# Altium schematic sheet Voeding.SchDoc
size A4; SheetNumber: 2; SheetTotal: 4
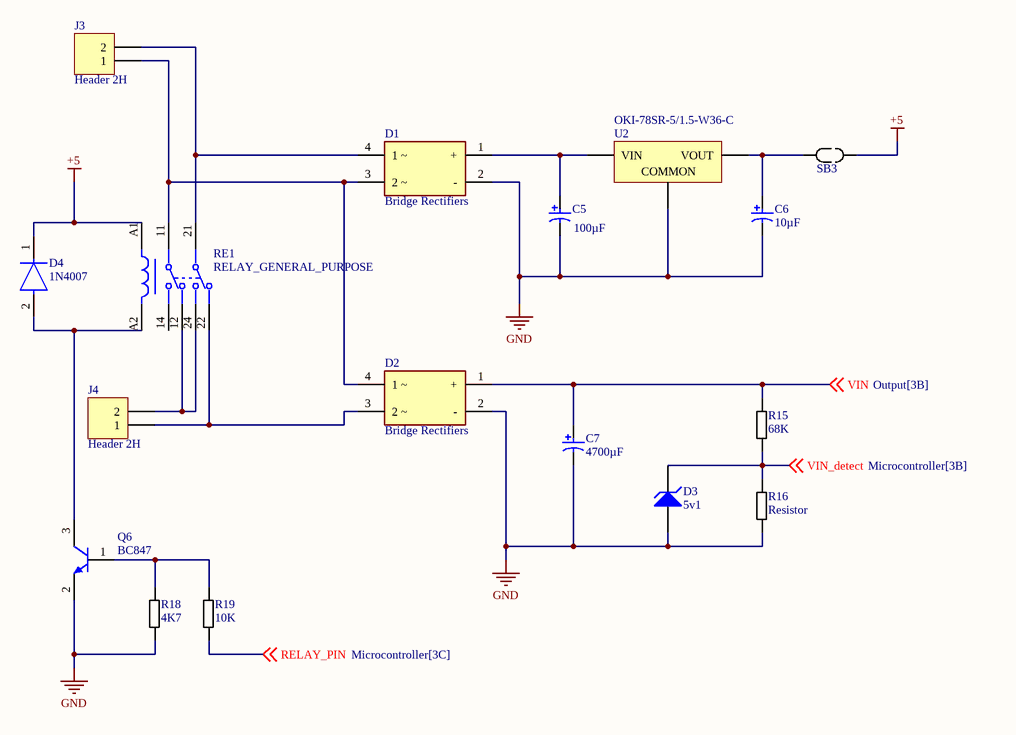
[diagram p0: Voeding.SchDoc]

## Parts
C5  100µF  [CAP-SMD_BD8.0-L8.3-W8.3-FD]
C6  10µF  [CAP-SMD_BD4.0-L4.3-W4.3-FD-LS5.3]
C7  4700µF  [CAP-TH_BD25.0-P10.00-D1.4-FD]
D1  Bridge Rectifiers  [TTF]
D2  Bridge Rectifiers  [TTF]
D3  5v1  [FP-SOD123-IPC_C]
D4  1N4007  [SOD-123FL]
J3  Header 2H  [Connector_2x1_p_5mm]
J4  Header 2H  [Connector_2x1_p_5mm]
Q6  BC847  [FAIR-SOT23-3_V]
R15  68K  [RESC2013X50X30ML20T20]
R16  Resistor  [RESC2013X50X30ML20T20]
R18  4K7  [RESC2013X50X30ML20T20]
R19  10K  [RESC2013X50X30ML20T20]
RE1  RELAY_GENERAL_PURPOSE  [RT42]
SB3  SolderBridge  [SolderBridge_BIG]  (value not drawn)
U2  OKI-78SR-5/1.5-W36-C  [OKI78SR515W36C]

## Nets
+5: D4.1(C) RE1.A1 SB3.2
GND: C5.2(-) C6.2(-) C7.2(-) D1.2(-) D2.2(-) D3.2(A) Q6.2(E) R16.1 R18.1 U2.2(COMMON)
RELAY_PIN: R19.1 ; off-sheet RELAY_PIN
VIN: C7.1(+) D2.1(+) R15.2 ; off-sheet VIN
VIN_detect: D3.1(K) R15.1 R16.2 ; off-sheet VIN_detect
NetC5_1: C5.1(+) D1.1(+) U2.1(VIN)
NetC6_1: C6.1(+) SB3.1 U2.3(VOUT)
NetD1_3: D1.3(2_~) D2.4(1_~) J3.1 RE1.11
NetD1_4: D1.4(1_~) J3.2 RE1.21
NetD2_3: D2.3(2_~) J4.1 RE1.22
NetD4_2: D4.2(A) Q6.3(C) RE1.A2
NetJ4_2: J4.2 RE1.12 RE1.24
NetQ6_1: Q6.1(B) R18.2 R19.2

Not connected (* = marked no-connect by the designer): RE1 14

## Library data of the parts
C5-C7 = Electrolytic capacitor: Manufacturer: Panasonic; Voltage Rating: 25 V; ComponentLink2URL: http://industrial.panasonic.com/cdbs/www-data/pdf/RDE0000/ABA0000C1181.pdf; Height: 10.2 mm; Max Operating Temperature: 105 degC; PackageReference: EEE-FK1E221P; ComponentLink1Description: Manufacturer URL; ComponentLink1URL: http://www.panasonic.com/; Mount: Surface Mount; REACH SVHC: No SVHC; Min Operating Temperature: -55 degC; ComponentLink2Description: Datasheet; DatasheetVersion: 03/2016; Length: 10.2 mm; RoHSCompliant: true; Packaging: Tape and Reel; Package Quantity: 500; Lead Pitch: 3.1 mm; Pins: 2; PackageDescription: 2-Pin Electrolytic Aluminum Capacitor, Body 8.3 x 8.3 mm; Mounting Technology: Surface Mount
D1 D2 = Bridge Rectifiers: Manufacturer Part Number: GBPC3510W T0; Manufacturer: Taiwan Semiconductor; Max Repetitive Reverse Voltage: 1000V; Peak Reverse Current: 5uA; Max Surge Forward Current: 400A; Forward Current: 35A; Max Junction Temp: +150°C; RoHS: TRUE; Package: GBPC-W; Reverse Voltage: 1000V; Temperature Range High: +150°C; Lead Free: Yes; ComponentLink2Description: Datasheet; Temperature Range Low: -55°C; Device Class L3: Rectifier Diodes; Temperature: -55°C to +150°C; Category: Diode; Octopart: https://octopart.com/gbpc3510w+t0-taiwan+semiconductor-12450781; Height: 11.23mm; ComponentLink2URL: https://www.taiwansemi.com/products/datasheet/GBPC%2015005%20SERIES_K14.pdf; Automotive: No; Device Class L2: Diodes; Device Class L1: Discrete Semiconductors
D3 = Zener: Manufacturer: On Semiconductor; PartNumber: 1SMB5928BT3G; VZ Typ (V): 13; Packing: Tape and Reel; PackageDescription: 2-Pin Small Molded Package, J-Bend Lead, Body 4.33 x 3.625 mm; PackageVersion: Rev. H, 05/2011; ComponentLink1Description: Manufacturer URL; Mounting Technology: Surface Mount; ComponentLink1URL: http://www.onsemi.com/; ComponentLink2Description: Datasheet; ComponentLink3URL: http://www.onsemi.com/pub_link/Collateral/1SMB5913BT3-D.PDF; PackageReference: SMB-2-403A-03_H; ComponentLink2URL: http://www.onsemi.com/pub_link/Collateral/1SMB5913BT3-D.PDF; DatasheetVersion: Rev. 8; RoHS: Pb-Free; ComponentLink3Description: Package Specification
D4 = Diode: Manufacturer: Vishay; Manufacturer Part Number: 1N4007-E3/54; Value: 15pF; Max Junction Temp: +150°C; Max Surge Forward Current: 30A; Forward Current: 1A; Max Repetitive Reverse Voltage: 1000V; Peak Reverse Current: 30uA; Octopart: https://octopart.com/1n4007-e3%2F54-vishay-39548207; Digikey Description: DIODE GEN PURP 1KV 1A DO204AL; Category: Diode; Mouser Description: Rectifiers Vr/1000V Io/1A; Automotive: No; Package: 1N4007; Device Class L3: Rectifier Diodes; Temperature Range High: +150°C; Capacitance: 15pF; Ipc Land Pattern Name: DIOPA1088W105L520D270; Lead Free: Yes; ComponentLink2Description: Datasheet; Device Class L1: Discrete Semiconductors; ComponentLink2URL: http://www.vishay.com/docs/88503/1n4001.pdf; Temperature Range Low: -50°C; Height: 2.7mm; RoHS: TRUE; Temperature: -50°C to +150°C; Device Class L2: Diodes
J3 J4 = Header 2H: Header, 2-Pin, Right Angle; LatestRevisionDate: 17-Jul-2002; LatestRevisionNote: Re-released for DXP Platform.; Publisher: Altium Limited
Q6 = NPN Transistor: Manufacturer: On Semiconductor; PartNumber: BC547BRL1G; IC Continuous (A): 0.1; fT Min (MHz): 150; Packing: Tape and Reel; Polarity: NPN; ComponentLink2URL: http://www.onsemi.com/pub_link/Collateral/BC546-D.PDF; ComponentLink1URL: http://www.onsemi.com/; ComponentLink2Description: Datasheet; RoHS: TRUE; ComponentLink3Description: Package Specification; ComponentLink1Description: Manufacturer URL; ComponentLink3URL: http://www.onsemi.com/pub_link/Collateral/MAC97-D.PDF; PackageDescription: 3-Pin Transistor Outline, Body 4.825 x 3.685 mm, Pitch 1.27 mm; PackageVersion: Rev. AM; DatasheetVersion: Rev. 7; Mounting Technology: Through Hole; PackageReference: TO-92-3-29-11_AM_BL
R15 R16 R18 R19 = Resistor: Manufacturer: Vishay Dale; Part Number: CRCW08050000Z0EA
RE1 = RELAY_GENERAL_PURPOSE: Manufacturer Part Number: RT424005; Manufacturer: TE Connectivity; Coil Power: 403mW; Throw Configuration: DPDT; Coil Voltage: 5V; Number Of Contacts: 2; Coil Resistance: 62Ω; Current Rating: 8A; Coil Type: Non-Latching; Category: Relay; Octopart: https://octopart.com/5-1393243-9-te+connectivity-41835766; Device Class L3: Power Relays; ComponentLink2URL: https://www.te.com/commerce/DocumentDelivery/DDEController?Action=showdoc&DocId=Data+Sheet%7FRT2%7F1014%7Fpdf%7FEnglish%7FENG_DS_RT2_1014.pdf%7F5-1393243-9; Ambient Temperature Range High: +85°C; ComponentLink2Description: Datasheet; Digikey Description: RELAY GENERAL PURPOSE DPDT 8A 5V; Package: RT424005; Automotive: No; Device Class L1: Electromechanical; Height: 15.7mm; Device Class L2: Relays; Ambient Temperature Range Low: -40°C; Mouser Description: General Purpose Relay, Rt2 Series, Power, Non Latching, Dpdt, 5 Vdc, 8 A Rohs Compliant: Yes; Lead Free: Yes; RoHS: TRUE
U2 = DC/DC Converter: Manufacturer: Murata; Current - Output (Max): 1.5A; Power (Watts) - Max: 8W; Efficiency: 90.5%; Voltage - Input (Min): 7V; Voltage - Input (Max): 36V; Voltage - Output 1: 5V; Number of Outputs: 1; Package / Case: 3-SIPModule; Features: SCP; Type: LinearRegulatorReplacement; Size / Dimension: 0.41"Lx0.30"Wx0.65"H(10.4mmx7.6mmx16.5mm); Datasheet URL: https://datasheet.ciiva.com/8006/1790439-8006672.pdf; Datasheet Version: Oct-13; Power (Watts) - Manufacture Series: 8W; Voltage - Output 2: -; Series: Okami™OKI-78SR; Family: DCDCConverters; Manufacturer URL: http://www.murata.com/; Category: PowerSupplies-BoardMount; Voltage - Isolation: -; Packaging: Tube; Applications: ITE(Commercial); Mounting Type: ThroughHole; Voltage - Output 3: -; Operating Temperature: -40degC~85degC